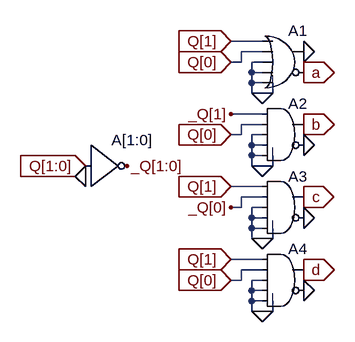
[diagram p0: schematic decoder_2bit.asc]
decoder_2bit.asc, the LTspice schematic file:
Version 4
SHEET 1 880 680
WIRE 48 -32 0 -32
WIRE 48 -16 16 -16
WIRE 16 0 16 -16
WIRE 16 0 0 0
WIRE 48 0 32 0
WIRE 32 16 32 0
WIRE 48 16 32 16
WIRE 32 32 32 16
WIRE 48 32 32 32
WIRE 32 48 32 32
WIRE 48 48 32 48
WIRE 64 48 64 32
WIRE 64 48 48 48
WIRE 48 80 0 80
WIRE 48 96 16 96
WIRE 16 112 16 96
WIRE 16 112 0 112
WIRE 48 112 32 112
WIRE 32 128 32 112
WIRE 48 128 32 128
WIRE 32 144 32 128
WIRE 48 144 32 144
WIRE 32 160 32 144
WIRE 48 160 32 160
WIRE 64 160 64 144
WIRE 64 160 48 160
WIRE 48 192 0 192
WIRE 48 208 16 208
WIRE 16 224 16 208
WIRE 16 224 0 224
WIRE 48 224 32 224
WIRE 32 240 32 224
WIRE 48 240 32 240
WIRE 32 256 32 240
WIRE 48 256 32 256
WIRE 32 272 32 256
WIRE 48 272 32 272
WIRE 64 272 64 256
WIRE 64 272 48 272
WIRE 48 304 0 304
WIRE 48 320 16 320
WIRE 16 336 16 320
WIRE 16 336 0 336
WIRE 48 336 32 336
WIRE 32 352 32 336
WIRE 48 352 32 352
WIRE 32 368 32 352
WIRE 48 368 32 368
WIRE 32 384 32 368
WIRE 48 384 32 384
WIRE 64 384 64 368
WIRE 64 384 48 384
FLAG 48 48 0
FLAG 112 -16 0
FLAG 112 96 b
IOPIN 112 96 Out
FLAG 112 208 c
IOPIN 112 208 Out
FLAG 112 320 d
IOPIN 112 320 Out
FLAG 112 16 a
IOPIN 112 16 Out
FLAG -224 160 Q[1:0]
IOPIN -224 160 In
FLAG -224 176 0
FLAG -160 160 _Q[1:0]
FLAG 0 -32 Q[1]
IOPIN 0 -32 In
FLAG 0 0 Q[0]
IOPIN 0 0 In
FLAG 48 160 0
FLAG 112 128 0
FLAG 0 112 Q[0]
IOPIN 0 112 In
FLAG 0 80 _Q[1]
FLAG 48 272 0
FLAG 112 240 0
FLAG 48 384 0
FLAG 112 352 0
FLAG 0 192 Q[1]
IOPIN 0 192 In
FLAG 0 224 _Q[0]
FLAG 0 304 Q[1]
IOPIN 0 304 In
FLAG 0 336 Q[0]
IOPIN 0 336 In
SYMBOL Digital\\or 80 -64 R0
SYMATTR InstName A1
SYMBOL Digital\\inv -224 96 R0
SYMATTR InstName A[1:0]
SYMBOL Digital\\and 80 48 R0
SYMATTR InstName A2
SYMBOL Digital\\and 80 160 R0
SYMATTR InstName A3
SYMBOL Digital\\and 80 272 R0
SYMATTR InstName A4

The netlist it stands for:
* decoder_2bit.asc
A1 Q[1] Q[0] 0 0 0 a 0 0 OR
A[1:0] Q[1:0] 0 0 0 0 _Q[1:0] 0 0 BUF
A2 _Q[1] Q[0] 0 0 0 0 b 0 AND
A3 Q[1] _Q[0] 0 0 0 0 c 0 AND
A4 Q[1] Q[0] 0 0 0 0 d 0 AND
.backanno
.end